# Altium project bdd_ext_pmm.PrjPcb
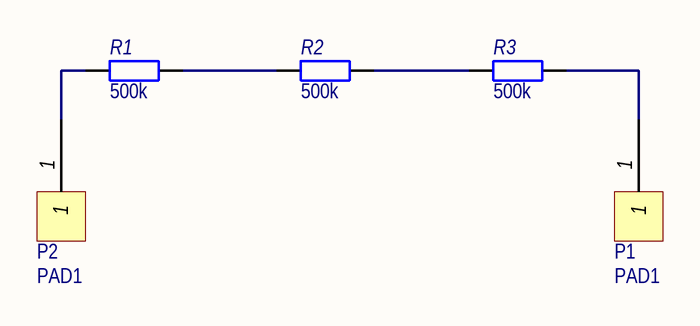
[diagram p0: bdd_ext_pmm.SchDoc]
Утвердил: Прокопьев; Разработал: Шигаев; Проверил: Прокопьев; NormInspection: Задорожная; GlobalProjectRevision: #1.0; GlobalProjectNumber: ЮМП...; GlobalProjectName2: модуля питания; GlobalProjectName1: БДД: доп. плата; GlobalProjectName: БДД: доп. плата модуля питания; GlobalOrganizationName: НГУ
1 sheet, 5 parts. Net scope: global (net labels, ports and power ports of the same name join across sheets).
Board file: bdd_ext_pmm.PcbDoc

## Sheet bdd_ext_pmm.SchDoc
size 209 x 297 mm; SheetNumber: 1; SheetTotal: 1; PageSetup: Record=PageOptions|CenterHorizontal=True|CenterVertical=True|PrintScale=1.00|XCorrection=1.00|YCorrection=1.00|PrintKind=1|BorderSize=5000000|LeftOffset=0|BottomOffset=0|Orientation=2|PaperLength=1000|PaperWidth=1000|Scale=100|PaperSource=15|PrintQuality=1200|MediaType=1|DitherType=10|PaperKind=A3|PrintScaleMode=1; Weight: -; ScaleFactor: -; FirstApplication: ЮМП...

### Parts
P1  PAD1  [PAD1]
P2  PAD1  [PAD1]
R1  value 500k  [SMD_2010_1]  (hidden comment: 2010)
R2  value 500k  [SMD_2010_1]  (hidden comment: 2010)
R3  value 500k  [SMD_2010_1]  (hidden comment: 2010)

### Nets
NetP1_1: P1.1 R3.2
NetP2_1: P2.1 R1.1
NetR1_2: R1.2 R2.1
NetR2_2: R2.2 R3.1

### Notes on the sheet
- Перв. примен.
- Справ. №
- Подп. и дата
- Инв. № дубл.
- Взам. инв. №
- Разраб.
- Изм.
- Лист
- № докум.
- Подп.
- Дата
- Литера
- Масса
- Масштаб
- Пров.
- Т.контр.
- Листов
- Инв. № подл.
- Н.контр.
- Утв.
- Форма 1 ГОСТ 2.104-2006
- Копировал
- Формат А4

### Library data of the parts
R1-R3 = Resistor: Наименование: R; Назначение: SMD-резистор; Потребление, Вт: 0,001; Точность: %